# EAGLE design main_brain (EAGLE 7.2.0)
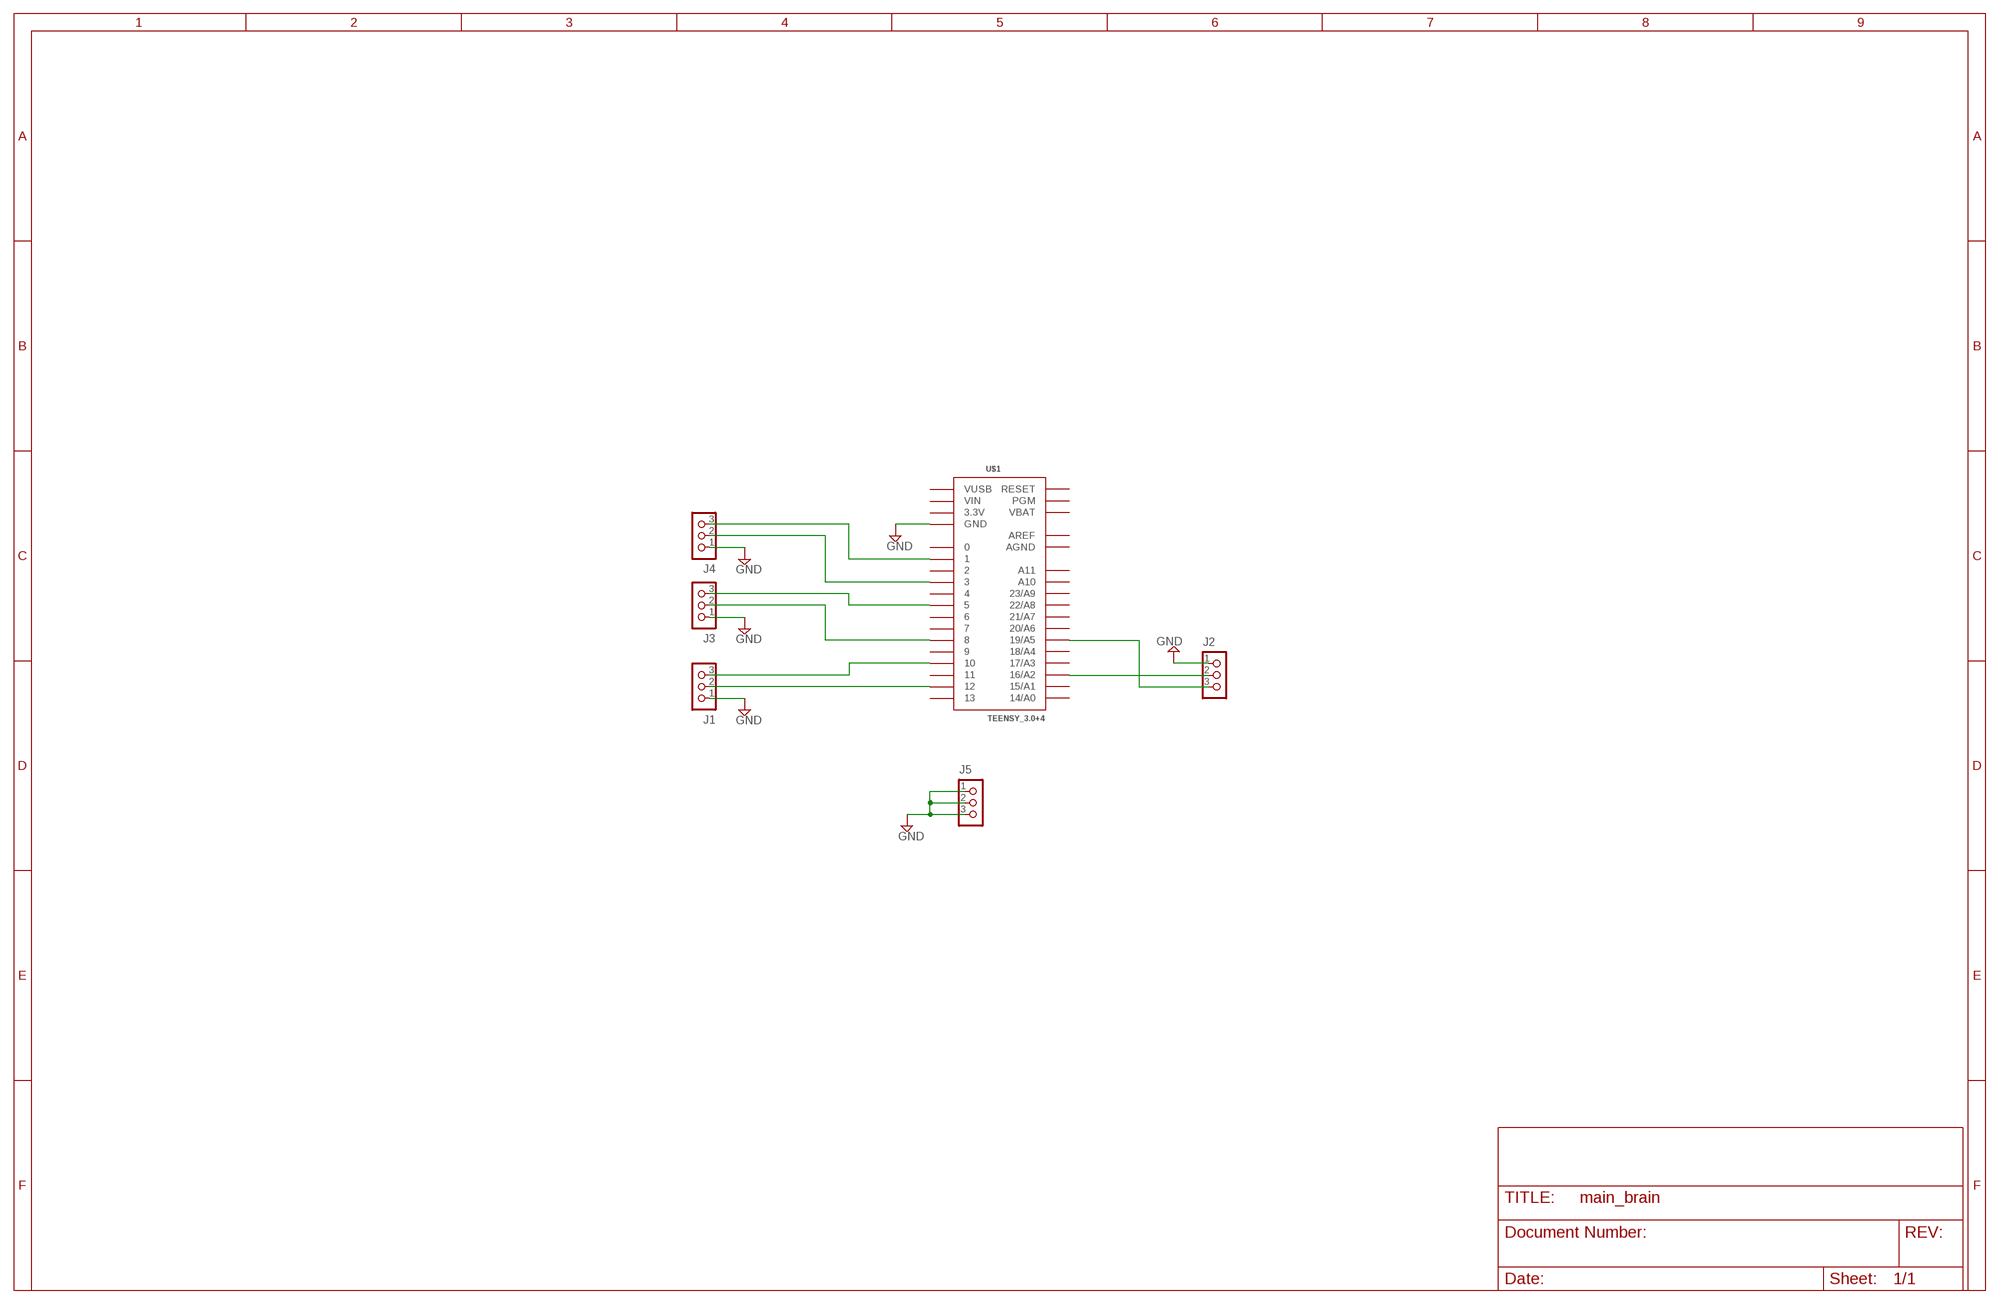
[diagram p0: schematic, sheet 1]

## Parts
J1  CON_TERMINAL_BLOCK_03-5MM  [TERMINAL_BLOCK_3P_5]
J2  CON_TERMINAL_BLOCK_03-5MM  [TERMINAL_BLOCK_3P_5]
J3  CON_TERMINAL_BLOCK_03-5MM  [TERMINAL_BLOCK_3P_5]
J4  CON_TERMINAL_BLOCK_03-5MM  [TERMINAL_BLOCK_3P_5]
J5  CON_TERMINAL_BLOCK_03-5MM  [TERMINAL_BLOCK_3P_5]
U$1  TEENSY_3.0+4  [TEENSY_3.0+4]

## Nets
GND: J1.1 J2.1 J3.1 J4.1 J5.1 J5.2 J5.3 U$1.GND U$1.GND1(GND)
N$1: J1.2 U$1.12
N$2: J4.2 U$1.3
N$3: J4.3 U$1.1
N$4: J3.3 U$1.5
N$5: J3.2 U$1.8
N$6: J1.3 U$1.10
N$7: J2.2 U$1.16/A2
N$8: J2.3 U$1.19/A5
Unconnected: U$1.0 U$1.2 U$1.4 U$1.6 U$1.7 U$1.9 U$1.11 U$1.13 U$1.14/A0 U$1.15/A1 U$1.17/A3 U$1.18/A4 U$1.20/A6 U$1.21/A7 U$1.22/A8 U$1.23/A9 U$1.A10 U$1.A11 U$1.PGM U$1.RESET

## Power pins joined to a net without a drawn wire
3.3V: U$1.3.3V U$1.3.3V1(3.3V)
AGND: U$1.AGND
AREF: U$1.AREF
VBAT: U$1.VBAT
VIN: U$1.VIN
VUSB: U$1.VUSB

## Library data of the parts
J1-J5 = dp_devices:CON_TERMINAL_BLOCK_03: 3 poles, wire to board connector
U$1 = Teensy3.0:TEENSY_3.0+4: Teensy 3.0 board, showing all pins that are easily acessible. See 'AllAnalogPins" and 'AllPins' packages for additional pin holes, as needed. The 'Basic' package has fewer pins.

## Board
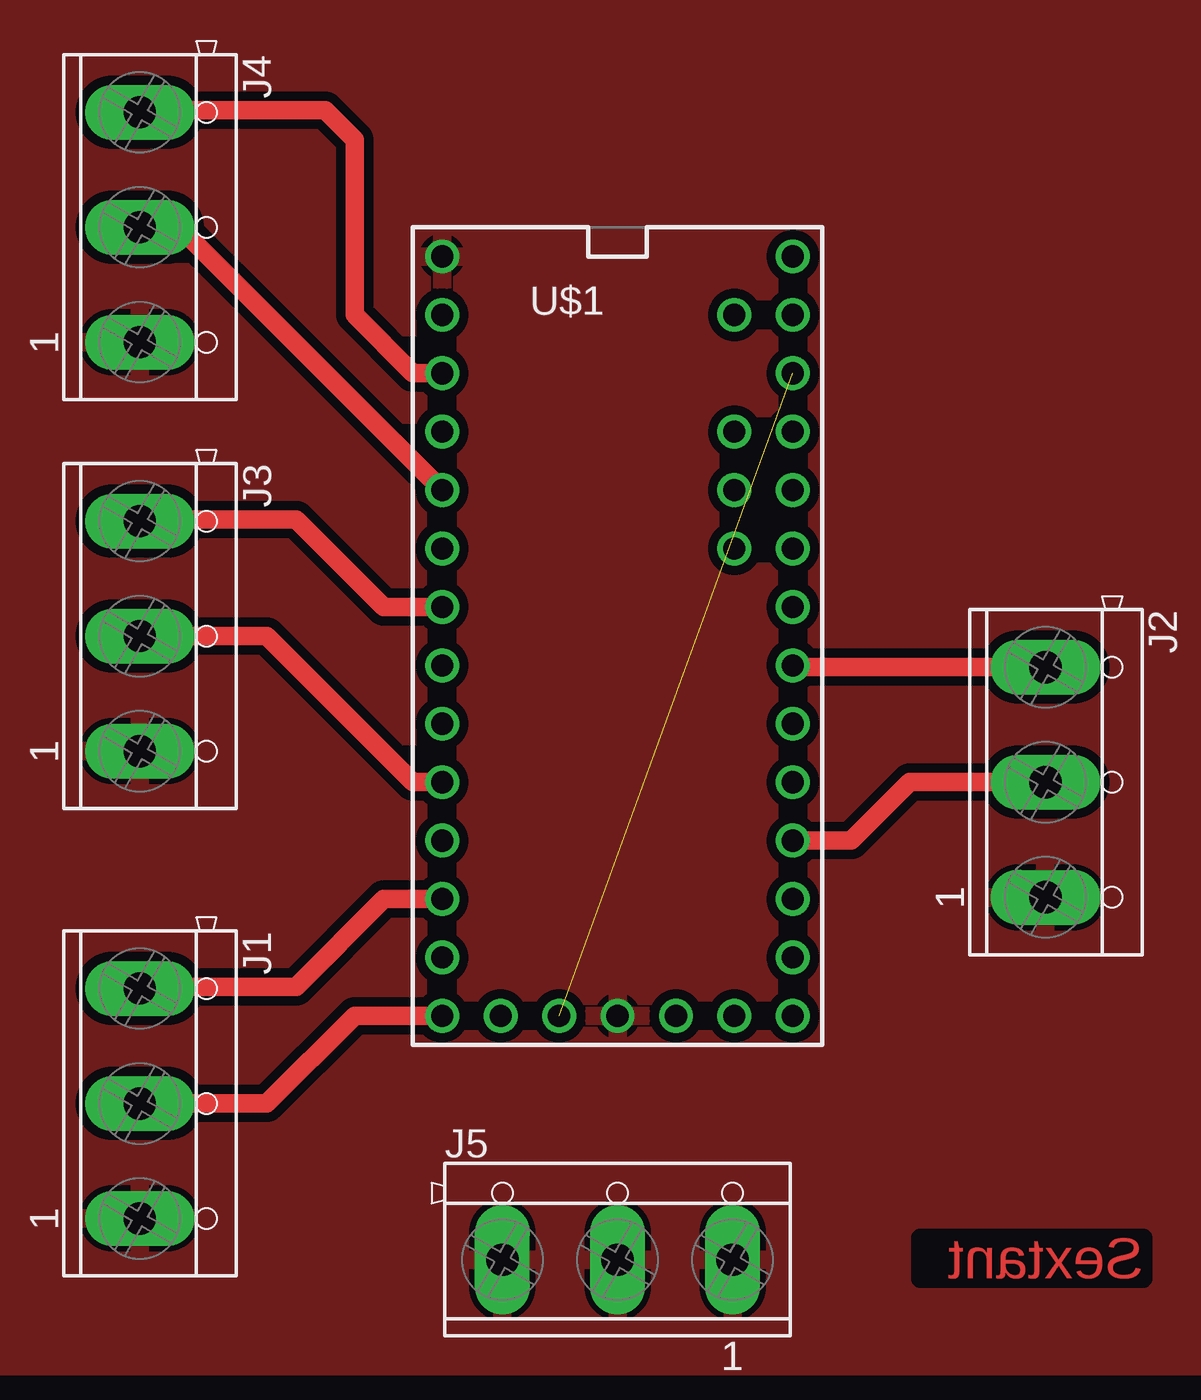
[diagram p1: board, top side]

No outline drawn. Coordinates in mm, seen from the top.
Copper layers (1*16): Top 0.035mm / dielectric 1.5mm / Bottom 0.035mm
Design rules "default": minimum track width 10mil, minimum drill 24mil, track to track 8mil, track to pad 8mil, pad to pad 8mil, via to via 8mil, smd to smd 8mil, copper to edge 40mil, drill to drill 8mil, minimum pad ring 10mil, minimum via ring 8mil, stop-mask expansion 4mil, vias tented up to drill 0mil, thermal gap 10mil

### Footprints (pad centres in the part's own frame; a part is rotated, then mirrored left to right if it is on the bottom)
TERMINAL_BLOCK_3P_5 = drill 1.4 pad 2.38 long: 1 5,-0.45; 2 0,-0.45; 3 -5,-0.45
TEENSY_3.0+4 = drill 0.965: 0 -7.62,13.97; 1 -7.62,11.43; 2 -7.62,8.89; 3 -7.62,6.35; 3.3V 7.62,11.43; 3.3V1 -2.54,-16.51; 4 -7.62,3.81; 5 -7.62,1.27; 6 -7.62,-1.27; 7 -7.62,-3.81; 8 -7.62,-6.35; 9 -7.62,-8.89; 10 -7.62,-11.43; 11 -7.62,-13.97; 12 -7.62,-16.51; 13 7.62,-16.51; 14/A0 7.62,-13.97; 15/A1 7.62,-11.43; 16/A2 7.62,-8.89; 17/A3 7.62,-6.35; 18/A4 7.62,-3.81; 19/A5 7.62,-1.27; 20/A6 7.62,1.27; 21/A7 7.62,3.81; 22/A8 7.62,6.35; 23/A9 7.62,8.89; A10 5.08,6.35; A11 5.08,3.81; AGND 7.62,13.97; AREF 5.08,8.89; GND -7.62,16.51; GND1 0,-16.51; PGM 2.54,-16.51; RESET 5.08,-16.51; VBAT -5.08,-16.51; VIN 7.62,16.51; VUSB 5.08,13.97

### Placement (x,y rotation side)
J1  8.89,13.97 270 top
J2  48.26,27.94 270 top
J3  8.89,34.29 270 top
J4  8.89,52.07 270 top
J5  29.21,7.62 0 top
U$1  29.21,34.29 0 top

### Tracks (layer width: path | path; a pad name or v marks a point on that pad's centre or on a via)
3.3V  (1 unrouted)
GND
  pour Top (isolate 0.406): 0,63.5 0,2.54 55.88,2.54 55.88,63.5
N$1
  Top 0.813: U$1.12 17.78,17.78 13.97,13.97 J1.2
N$2
  Top 0.813: U$1.3 10.16,52.07 J4.2
N$3
  Top 0.813: U$1.1 20.32,45.72 17.78,48.26 17.78,55.88 16.51,57.15 8.52,57.15 J4.3
N$4
  Top 0.813: U$1.5 19.05,35.56 15.24,39.37 8.52,39.37 J3.3
N$5
  Top 0.813: U$1.8 20.32,27.94 13.97,34.29 J3.2
N$6
  Top 0.813: U$1.10 19.05,22.86 15.24,19.05 8.52,19.05 J1.3
N$7
  Top 0.813: J2.2 41.91,27.94 39.37,25.4 U$1.16/A2
N$8
  Top 0.813: J2.3 36.91,32.94 U$1.19/A5

### Text on the board
Top: Sextant